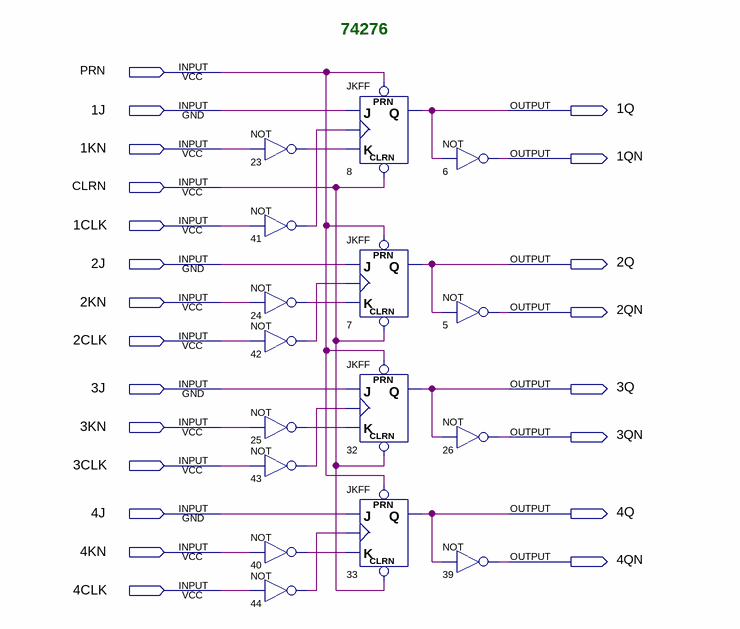
[diagram p0: schematic sheet]
// Quartus schematic 74276.bdf as structural Verilog: 16 symbols, 22 pins
module \74276  (
  input  PRN,
  input  \1J ,
  input  \1KN ,
  input  CLRN,
  input  \1CLK ,
  input  \2J ,
  input  \2KN ,
  input  \2CLK ,
  input  \3J ,
  input  \3KN ,
  input  \3CLK ,
  input  \4J ,
  input  \4KN ,
  input  \4CLK ,
  output \1Q ,
  output \1QN ,
  output \2Q ,
  output \2QN ,
  output \3Q ,
  output \3QN ,
  output \4Q ,
  output \4QN 
);

  wire n23_out, n24_out, n25_out, n40_out, n41_out, n42_out, n43_out, n44_out;

  not u_23 (n23_out, \1KN );
  not u_41 (n41_out, \1CLK );
  not u_24 (n24_out, \2KN );
  not u_42 (n42_out, \2CLK );
  not u_25 (n25_out, \3KN );
  not u_43 (n43_out, \3CLK );
  not u_40 (n40_out, \4KN );
  not u_44 (n44_out, \4CLK );
  JKFF u_8 (.PRN(PRN), .CLRN(CLRN), .K(n23_out), .J(\1J ), .CLK(n41_out), .Q(\1Q ));
  JKFF u_7 (.PRN(PRN), .CLRN(CLRN), .K(n24_out), .J(\2J ), .CLK(n42_out), .Q(\2Q ));
  JKFF u_32 (.PRN(PRN), .CLRN(CLRN), .K(n25_out), .J(\3J ), .CLK(n43_out), .Q(\3Q ));
  JKFF u_33 (.PRN(PRN), .CLRN(CLRN), .K(n40_out), .J(\4J ), .CLK(n44_out), .Q(\4Q ));
  not u_6 (\1QN , \1Q );
  not u_5 (\2QN , \2Q );
  not u_26 (\3QN , \3Q );
  not u_39 (\4QN , \4Q );

  // Notes on the sheet:
  //   74276
endmodule
